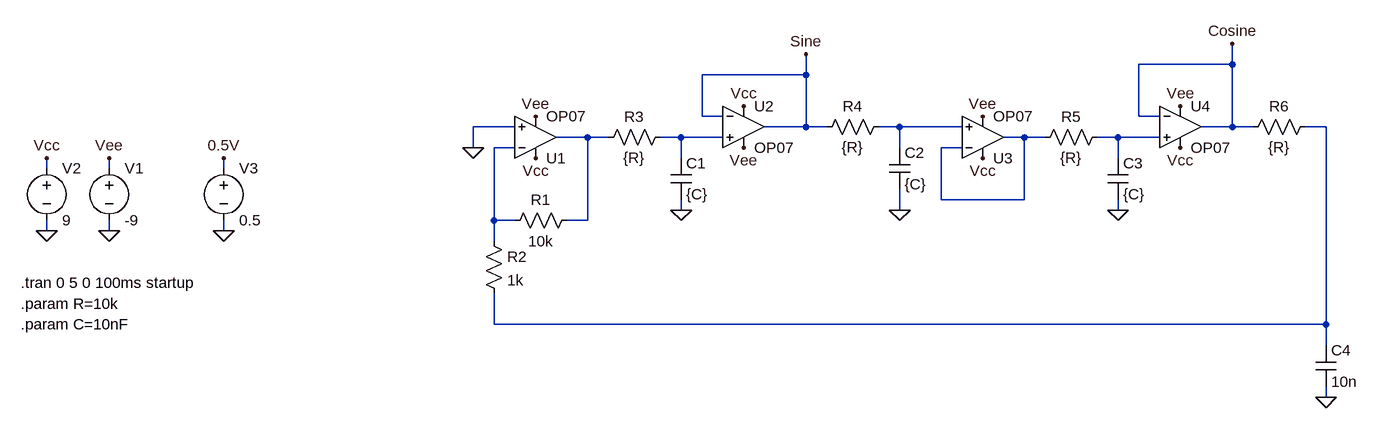
[diagram p0: schematic Sinusoid demo.asc]
Sinusoid demo.asc, the LTspice schematic file:
Version 4
SHEET 1 2040 680
WIRE 1840 -48 1840 -80
WIRE 1840 -48 1696 -48
WIRE 1184 -32 1184 -64
WIRE 1184 -32 1024 -32
WIRE 1024 32 1024 -32
WIRE 1056 32 1024 32
WIRE 1696 32 1696 -48
WIRE 1728 32 1696 32
WIRE 736 48 672 48
WIRE 1184 48 1184 -32
WIRE 1184 48 1120 48
WIRE 1216 48 1184 48
WIRE 1328 48 1296 48
WIRE 1424 48 1328 48
WIRE 1840 48 1840 -48
WIRE 1840 48 1792 48
WIRE 1872 48 1840 48
WIRE 1984 48 1952 48
WIRE 848 64 800 64
WIRE 880 64 848 64
WIRE 992 64 960 64
WIRE 1056 64 992 64
WIRE 1520 64 1488 64
WIRE 1552 64 1520 64
WIRE 1664 64 1632 64
WIRE 1728 64 1664 64
WIRE 672 80 672 48
WIRE 736 80 704 80
WIRE 1328 80 1328 48
WIRE 1424 80 1392 80
WIRE 992 96 992 64
WIRE 1664 96 1664 64
WIRE 16 112 16 96
WIRE 112 112 112 96
WIRE 288 112 288 96
WIRE 1392 160 1392 80
WIRE 1520 160 1520 64
WIRE 1520 160 1392 160
WIRE 992 176 992 160
WIRE 1328 176 1328 144
WIRE 1664 176 1664 160
WIRE 704 192 704 80
WIRE 736 192 704 192
WIRE 848 192 848 64
WIRE 848 192 816 192
WIRE 16 208 16 192
WIRE 112 208 112 192
WIRE 288 208 288 192
WIRE 704 224 704 192
WIRE 704 352 704 304
WIRE 1984 352 1984 48
WIRE 1984 352 704 352
WIRE 1984 384 1984 352
WIRE 1984 464 1984 448
FLAG 16 208 0
FLAG 112 208 0
FLAG 112 96 Vee
FLAG 16 96 Vcc
FLAG 768 96 Vcc
FLAG 768 32 Vee
FLAG 992 176 0
FLAG 1088 80 Vee
FLAG 1088 16 Vcc
FLAG 1184 -64 Sine
FLAG 1328 176 0
FLAG 1456 96 Vcc
FLAG 1456 32 Vee
FLAG 1664 176 0
FLAG 1760 80 Vcc
FLAG 1760 16 Vee
FLAG 1984 464 0
FLAG 1840 -80 Cosine
FLAG 288 208 0
FLAG 288 96 0.5V
FLAG 672 80 0
SYMBOL voltage 112 96 R0
SYMATTR InstName V1
SYMATTR Value -9
SYMBOL voltage 16 96 R0
SYMATTR InstName V2
SYMATTR Value 9
SYMBOL OpAmps\\OP07 768 128 M180
SYMATTR InstName U1
SYMBOL res 832 176 R90
WINDOW 0 0 56 VBottom 2
WINDOW 3 32 56 VTop 2
SYMATTR InstName R1
SYMATTR Value 10k
SYMBOL res 688 208 R0
SYMATTR InstName R2
SYMATTR Value 1k
SYMBOL res 976 48 R90
WINDOW 0 0 56 VBottom 2
WINDOW 3 32 56 VTop 2
SYMATTR InstName R3
SYMATTR Value {R}
SYMBOL cap 976 96 R0
SYMATTR InstName C1
SYMATTR Value {C}
SYMBOL OpAmps\\OP07 1088 -16 R0
SYMATTR InstName U2
SYMBOL res 1312 32 R90
WINDOW 0 0 56 VBottom 2
WINDOW 3 32 56 VTop 2
SYMATTR InstName R4
SYMATTR Value {R}
SYMBOL cap 1312 80 R0
SYMATTR InstName C2
SYMATTR Value {C}
SYMBOL OpAmps\\OP07 1456 128 M180
SYMATTR InstName U3
SYMBOL res 1648 48 R90
WINDOW 0 0 56 VBottom 2
WINDOW 3 32 56 VTop 2
SYMATTR InstName R5
SYMATTR Value {R}
SYMBOL cap 1648 96 R0
SYMATTR InstName C3
SYMATTR Value {C}
SYMBOL OpAmps\\OP07 1760 -16 R0
SYMATTR InstName U4
SYMBOL res 1968 32 R90
WINDOW 0 0 56 VBottom 2
WINDOW 3 32 56 VTop 2
SYMATTR InstName R6
SYMATTR Value {R}
SYMBOL cap 1968 384 R0
SYMATTR InstName C4
SYMATTR Value 10n
SYMBOL voltage 288 96 R0
SYMATTR InstName V3
SYMATTR Value 0.5
TEXT -24 288 Left 2 !.tran 0 5 0 100ms startup
TEXT -24 320 Left 2 !.param R=10k
TEXT -24 352 Left 2 !.param C=10nF

The netlist it stands for:
* Sinusoid demo.asc
V1 Vee 0 -9
V2 Vcc 0 9
XU1 0 N007 Vcc Vee N003 LT1001  ; OP07, pins In+ In- V+ V- OUT
R1 N003 N007 10k
R2 N007 N002 1k
R3 N004 N003 {R}
C1 N004 0 {C}
XU2 N004 Sine Vcc Vee Sine LT1001  ; OP07, pins In+ In- V+ V- OUT
R4 N001 Sine {R}
C2 N001 0 {C}
XU3 N001 N005 Vcc Vee N005 LT1001  ; OP07, pins In+ In- V+ V- OUT
R5 N006 N005 {R}
C3 N006 0 {C}
XU4 N006 Cosine Vee Vcc Cosine LT1001  ; OP07, pins In+ In- V+ V- OUT
R6 N002 Cosine {R}
C4 N002 0 10n
V3 0.5V 0 0.5
.tran 0 5 0 100ms startup
.param R=10k
.param C=10nF
.lib LTC.lib
.backanno
.end